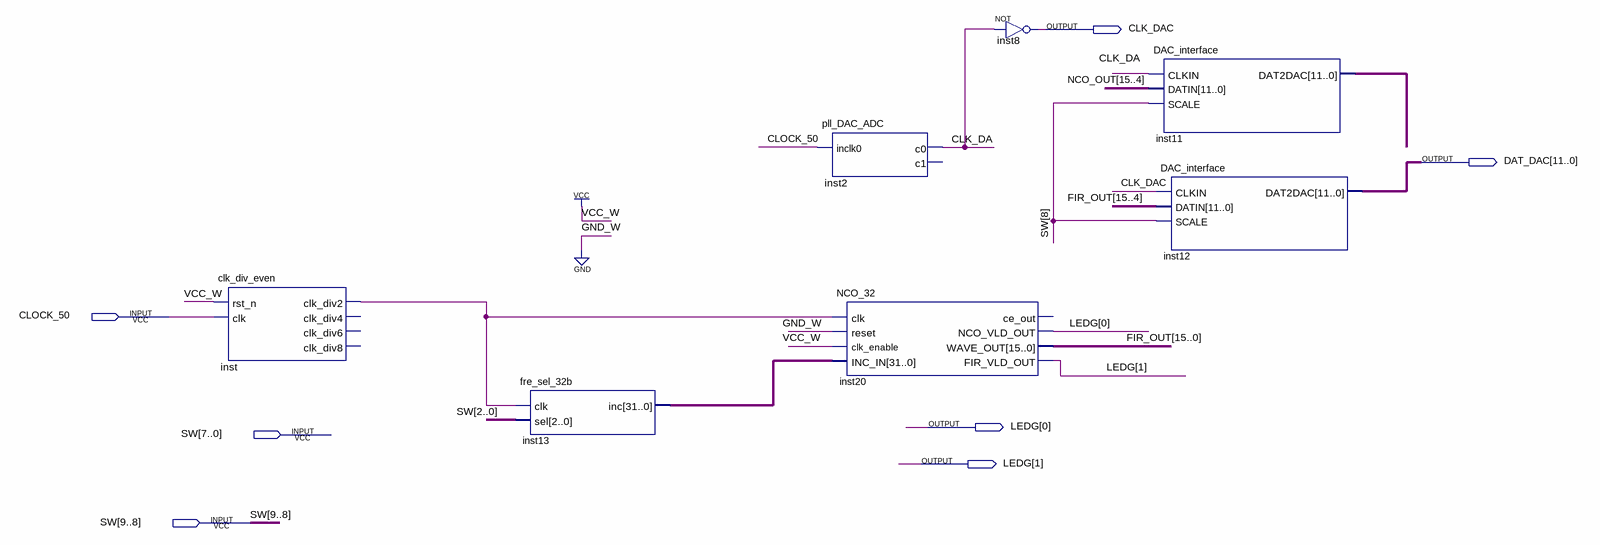
[diagram p0: schematic sheet]
// Quartus schematic DDS_quartus.bdf as structural Verilog: 7 symbols, 7 pins
module DDS_quartus (
  input  CLOCK_50,
  input  [9:0] SW,
  output CLK_DAC,
  output [11:0] DAT_DAC,
  output [1:0] LEDG
);

  wire CLK_DA, inst_clk_div2;
  wire [11:0] inst11_dat2dac;
  wire [15:0] FIR_OUT;
  wire [15:4] NCO_OUT;
  wire [31:0] inst13_inc;

  clk_div_even inst (.rst_n(1'b1), .clk(CLOCK_50), .clk_div2(inst_clk_div2));  // open: clk_div4, clk_div6, clk_div8
  fre_sel_32b inst13 (.clk(inst_clk_div2), .sel(SW[2:0]), .inc(inst13_inc));
  pll_DAC_ADC inst2 (.inclk0(CLOCK_50), .c0(CLK_DA));  // open: c1
  NCO_32 inst20 (
    .clk(inst_clk_div2), .reset(1'b0), .clk_enable(1'b1), .INC_IN(inst13_inc), .NCO_VLD_OUT(LEDG[0]),
    .WAVE_OUT(FIR_OUT), .FIR_VLD_OUT(LEDG[1]));  // open: ce_out
  not inst8 (CLK_DAC, CLK_DA);
  DAC_interface inst11 (.CLKIN(CLK_DA), .DATIN(NCO_OUT), .SCALE(SW[8]), .DAT2DAC(inst11_dat2dac));
  DAC_interface inst12 (.CLKIN(CLK_DAC), .DATIN(FIR_OUT[15:4]), .SCALE(SW[8]), .DAT2DAC(DAT_DAC));
endmodule
